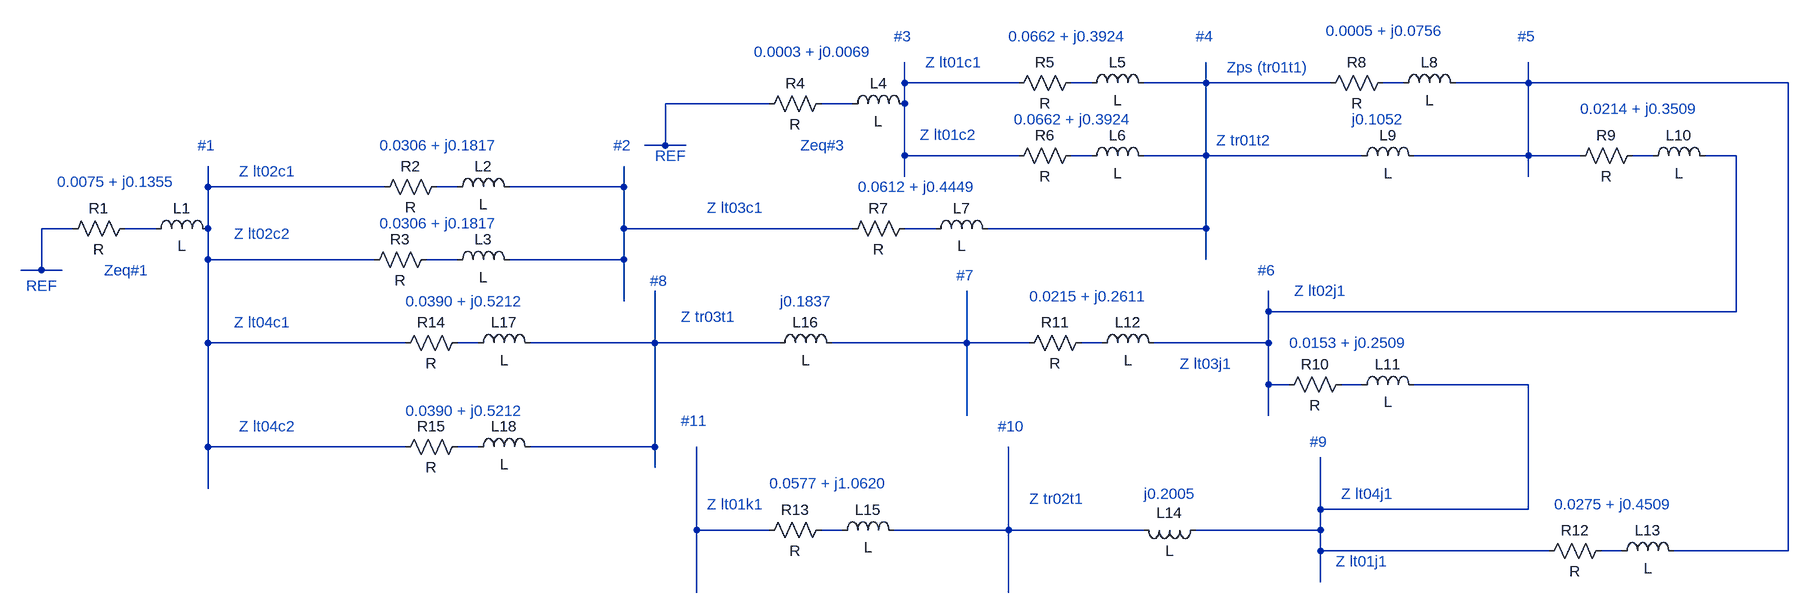
[diagram p0: schematic Diagrama seq negativa.asc]
Diagrama seq negativa.asc, the LTspice schematic file:
Version 4
SHEET 1 2548 696
WIRE 1184 -192 1184 -224
WIRE 1360 -192 1184 -192
WIRE 1472 -192 1440 -192
WIRE 1648 -192 1648 -224
WIRE 1648 -192 1552 -192
WIRE 1840 -192 1648 -192
WIRE 1952 -192 1920 -192
WIRE 2144 -192 2144 -224
WIRE 2144 -192 2032 -192
WIRE 2544 -192 2144 -192
WIRE 976 -160 816 -160
WIRE 1104 -160 1056 -160
WIRE 1184 -160 1184 -192
WIRE 816 -96 816 -160
WIRE 816 -96 784 -96
WIRE 848 -96 816 -96
WIRE 1184 -80 1184 -160
WIRE 1360 -80 1184 -80
WIRE 1472 -80 1440 -80
WIRE 1648 -80 1648 -192
WIRE 1648 -80 1552 -80
WIRE 1888 -80 1648 -80
WIRE 2144 -80 2144 -192
WIRE 2144 -80 1968 -80
WIRE 2224 -80 2144 -80
WIRE 2336 -80 2304 -80
WIRE 2464 -80 2416 -80
WIRE 1184 -48 1184 -80
WIRE 2144 -48 2144 -80
WIRE 112 -32 112 -64
WIRE 384 -32 112 -32
WIRE 496 -32 464 -32
WIRE 752 -32 752 -64
WIRE 752 -32 576 -32
WIRE -96 32 -144 32
WIRE 32 32 -16 32
WIRE 112 32 112 -32
WIRE 752 32 752 -32
WIRE 1104 32 752 32
WIRE 1232 32 1184 32
WIRE 1648 32 1648 -80
WIRE 1648 32 1312 32
WIRE 112 80 112 32
WIRE 368 80 112 80
WIRE 496 80 448 80
WIRE 752 80 752 32
WIRE 752 80 576 80
WIRE 1648 80 1648 32
WIRE -144 96 -144 32
WIRE -144 96 -176 96
WIRE -112 96 -144 96
WIRE 752 144 752 80
WIRE 1744 160 1744 128
WIRE 2464 160 2464 -80
WIRE 2464 160 1744 160
WIRE 112 208 112 80
WIRE 416 208 112 208
WIRE 528 208 496 208
WIRE 800 208 800 128
WIRE 800 208 608 208
WIRE 992 208 800 208
WIRE 1280 208 1280 128
WIRE 1280 208 1072 208
WIRE 1376 208 1280 208
WIRE 1488 208 1456 208
WIRE 1744 208 1744 160
WIRE 1744 208 1568 208
WIRE 1744 272 1744 208
WIRE 1776 272 1744 272
WIRE 1888 272 1856 272
WIRE 2144 272 1968 272
WIRE 1280 320 1280 208
WIRE 1744 320 1744 272
WIRE 112 368 112 208
WIRE 416 368 112 368
WIRE 528 368 496 368
WIRE 800 368 800 208
WIRE 800 368 608 368
WIRE 800 400 800 368
WIRE 112 432 112 368
WIRE 1824 464 1824 384
WIRE 2144 464 2144 272
WIRE 2144 464 1824 464
WIRE 864 496 864 368
WIRE 976 496 864 496
WIRE 1088 496 1056 496
WIRE 1344 496 1344 368
WIRE 1344 496 1168 496
WIRE 1552 496 1344 496
WIRE 1824 496 1824 464
WIRE 1824 496 1632 496
WIRE 1824 528 1824 496
WIRE 2176 528 1824 528
WIRE 2288 528 2256 528
WIRE 2544 528 2544 -192
WIRE 2544 528 2368 528
WIRE 1824 576 1824 528
WIRE 864 592 864 496
WIRE 1344 592 1344 496
SYMBOL res 0 16 R90
WINDOW 0 0 56 VBottom 2
WINDOW 3 32 56 VTop 2
SYMATTR InstName R1
SYMBOL ind 16 48 R270
WINDOW 0 32 56 VTop 2
WINDOW 3 5 56 VBottom 2
SYMATTR InstName L1
SYMBOL res 480 -48 R90
WINDOW 0 0 56 VBottom 2
WINDOW 3 32 56 VTop 2
SYMATTR InstName R2
SYMBOL ind 480 -16 R270
WINDOW 0 32 56 VTop 2
WINDOW 3 5 56 VBottom 2
SYMATTR InstName L2
SYMBOL ind 480 96 R270
WINDOW 0 32 56 VTop 2
WINDOW 3 5 56 VBottom 2
SYMATTR InstName L3
SYMBOL res 464 64 R90
WINDOW 0 0 56 VBottom 2
WINDOW 3 32 56 VTop 2
SYMATTR InstName R3
SYMBOL res 1072 -176 R90
WINDOW 0 0 56 VBottom 2
WINDOW 3 32 56 VTop 2
SYMATTR InstName R4
SYMBOL ind 1088 -144 R270
WINDOW 0 32 56 VTop 2
WINDOW 3 5 56 VBottom 2
SYMATTR InstName L4
SYMBOL res 1456 -208 R90
WINDOW 0 0 56 VBottom 2
WINDOW 3 32 56 VTop 2
SYMATTR InstName R5
SYMBOL ind 1456 -176 R270
WINDOW 0 32 56 VTop 2
WINDOW 3 5 56 VBottom 2
SYMATTR InstName L5
SYMBOL res 1456 -96 R90
WINDOW 0 0 56 VBottom 2
WINDOW 3 32 56 VTop 2
SYMATTR InstName R6
SYMBOL ind 1456 -64 R270
WINDOW 0 32 56 VTop 2
WINDOW 3 5 56 VBottom 2
SYMATTR InstName L6
SYMBOL res 1200 16 R90
WINDOW 0 0 56 VBottom 2
WINDOW 3 32 56 VTop 2
SYMATTR InstName R7
SYMBOL ind 1216 48 R270
WINDOW 0 32 56 VTop 2
WINDOW 3 5 56 VBottom 2
SYMATTR InstName L7
SYMBOL res 1936 -208 R90
WINDOW 0 0 56 VBottom 2
WINDOW 3 32 56 VTop 2
SYMATTR InstName R8
SYMBOL ind 1936 -176 R270
WINDOW 0 32 56 VTop 2
WINDOW 3 5 56 VBottom 2
SYMATTR InstName L8
SYMBOL ind 1872 -64 R270
WINDOW 0 32 56 VTop 2
WINDOW 3 5 56 VBottom 2
SYMATTR InstName L9
SYMBOL res 2320 -96 R90
WINDOW 0 0 56 VBottom 2
WINDOW 3 32 56 VTop 2
SYMATTR InstName R9
SYMBOL ind 2320 -64 R270
WINDOW 0 32 56 VTop 2
WINDOW 3 5 56 VBottom 2
SYMATTR InstName L10
SYMBOL res 1872 256 R90
WINDOW 0 0 56 VBottom 2
WINDOW 3 32 56 VTop 2
SYMATTR InstName R10
SYMBOL ind 1872 288 R270
WINDOW 0 32 56 VTop 2
WINDOW 3 5 56 VBottom 2
SYMATTR InstName L11
SYMBOL res 1472 192 R90
WINDOW 0 0 56 VBottom 2
WINDOW 3 32 56 VTop 2
SYMATTR InstName R11
SYMBOL ind 1472 224 R270
WINDOW 0 32 56 VTop 2
WINDOW 3 5 56 VBottom 2
SYMATTR InstName L12
SYMBOL res 2272 512 R90
WINDOW 0 0 56 VBottom 2
WINDOW 3 32 56 VTop 2
SYMATTR InstName R12
SYMBOL ind 2272 544 R270
WINDOW 0 32 56 VTop 2
WINDOW 3 5 56 VBottom 2
SYMATTR InstName L13
SYMBOL ind 1648 480 R90
WINDOW 0 5 56 VBottom 2
WINDOW 3 32 56 VTop 2
SYMATTR InstName L14
SYMBOL res 1072 480 R90
WINDOW 0 0 56 VBottom 2
WINDOW 3 32 56 VTop 2
SYMATTR InstName R13
SYMBOL ind 1072 512 R270
WINDOW 0 32 56 VTop 2
WINDOW 3 5 56 VBottom 2
SYMATTR InstName L15
SYMBOL ind 976 224 R270
WINDOW 0 32 56 VTop 2
WINDOW 3 5 56 VBottom 2
SYMATTR InstName L16
SYMBOL res 512 192 R90
WINDOW 0 0 56 VBottom 2
WINDOW 3 32 56 VTop 2
SYMATTR InstName R14
SYMBOL ind 512 224 R270
WINDOW 0 32 56 VTop 2
WINDOW 3 5 56 VBottom 2
SYMATTR InstName L17
SYMBOL res 512 352 R90
WINDOW 0 0 56 VBottom 2
WINDOW 3 32 56 VTop 2
SYMATTR InstName R15
SYMBOL ind 512 384 R270
WINDOW 0 32 56 VTop 2
WINDOW 3 5 56 VBottom 2
SYMATTR InstName L18
TEXT -168 120 Left 2 ;REF
TEXT 376 -96 Left 2 ;0.0306 + j0.1817
TEXT 376 24 Left 2 ;0.0306 + j0.1817
TEXT 160 -56 Left 2 ;Z lt02c1
TEXT 152 40 Left 2 ;Z lt02c2
TEXT -48 96 Left 2 ;Zeq#1
TEXT -120 -40 Left 2 ;0.0075 + j0.1355
TEXT 96 -96 Left 2 ;#1
TEXT 736 -96 Left 2 ;#2
TEXT 800 -80 Left 2 ;REF
TEXT 1024 -96 Left 2 ;Zeq#3
TEXT 952 -240 Left 2 ;0.0003 + j0.0069
TEXT 1344 -264 Left 2 ;0.0662 + j0.3924
TEXT 1352 -136 Left 2 ;0.0662 + j0.3924
TEXT 1216 -224 Left 2 ;Z lt01c1
TEXT 1208 -112 Left 2 ;Z lt01c2
TEXT 1168 -264 Left 2 ;#3
TEXT 1632 -264 Left 2 ;#4
TEXT 880 0 Left 2 ;Z lt03c1
TEXT 1112 -32 Left 2 ;0.0612 + j0.4449
TEXT 2128 -264 Left 2 ;#5
TEXT 1680 -216 Left 2 ;Zps (tr01t1)
TEXT 1664 -104 Left 2 ;Z tr01t2
TEXT 1832 -272 Left 2 ;0.0005 + j0.0756
TEXT 1872 -136 Left 2 ;j0.1052
TEXT 1728 96 Left 2 ;#6
TEXT 1808 360 Left 2 ;#9
TEXT 1784 128 Left 2 ;Z lt02j1
TEXT 2224 -152 Left 2 ;0.0214 + j0.3509
TEXT 1856 440 Left 2 ;Z lt04j1
TEXT 1776 208 Left 2 ;0.0153 + j0.2509
TEXT 1264 104 Left 2 ;#7
TEXT 1376 136 Left 2 ;0.0215 + j0.2611
TEXT 1608 240 Left 2 ;Z lt03j1
TEXT 1848 544 Left 2 ;Z lt01j1
TEXT 2184 456 Left 2 ;0.0275 + j0.4509
TEXT 1328 336 Left 2 ;#10
TEXT 1552 440 Left 2 ;j0.2005
TEXT 1376 448 Left 2 ;Z tr02t1
TEXT 976 424 Left 2 ;0.0577 + j1.0620
TEXT 880 456 Left 2 ;Z lt01k1
TEXT 840 328 Left 2 ;#11
TEXT 792 112 Left 2 ;#8
TEXT 840 168 Left 2 ;Z tr03t1
TEXT 992 144 Left 2 ;j0.1837
TEXT 152 176 Left 2 ;Z lt04c1
TEXT 160 336 Left 2 ;Z lt04c2
TEXT 416 144 Left 2 ;0.0390 + j0.5212
TEXT 416 312 Left 2 ;0.0390 + j0.5212

The netlist it stands for:
* Diagrama seq negativa.asc
R1 N015 N014 R
L1 N015 N011 L
R2 N012 N011 R
L2 N012 N013 L
L3 N017 N013 L
R3 N017 N011 R
R4 N007 N006 R
L4 N007 N001 L
R5 N002 N001 R
L5 N002 N003 L
R6 N008 N001 R
L6 N008 N003 L
R7 N016 N013 R
L7 N016 N003 L
R8 N004 N003 R
L8 N004 N005 L
L9 N003 N005 L
R9 N009 N005 R
L10 N009 N010 L
R10 N022 N010 R
L11 N022 N023 L
R11 N021 N020 R
L12 N021 N010 L
R12 N028 N023 R
L13 N028 N005 L
L14 N023 N027 L
R13 N026 N025 R
L15 N026 N027 L
L16 N019 N020 L
R14 N018 N011 R
L17 N018 N019 L
R15 N024 N011 R
L18 N024 N019 L
* REF
* 0.0306 + j0.1817
* 0.0306 + j0.1817
* Z lt02c1
* Z lt02c2
* Zeq#1
* 0.0075 + j0.1355
* #1
* #2
* REF
* Zeq#3
* 0.0003 + j0.0069
* 0.0662 + j0.3924
* 0.0662 + j0.3924
* Z lt01c1
* Z lt01c2
* #3
* #4
* Z lt03c1
* 0.0612 + j0.4449
* #5
* Zps (tr01t1)
* Z tr01t2
* 0.0005 + j0.0756
* j0.1052
* #6
* #9
* Z lt02j1
* 0.0214 + j0.3509
* Z lt04j1
* 0.0153 + j0.2509
* #7
* 0.0215 + j0.2611
* Z lt03j1
* Z lt01j1
* 0.0275 + j0.4509
* #10
* j0.2005
* Z tr02t1
* 0.0577 + j1.0620
* Z lt01k1
* #11
* #8
* Z tr03t1
* j0.1837
* Z lt04c1
* Z lt04c2
* 0.0390 + j0.5212
* 0.0390 + j0.5212
.backanno
.end